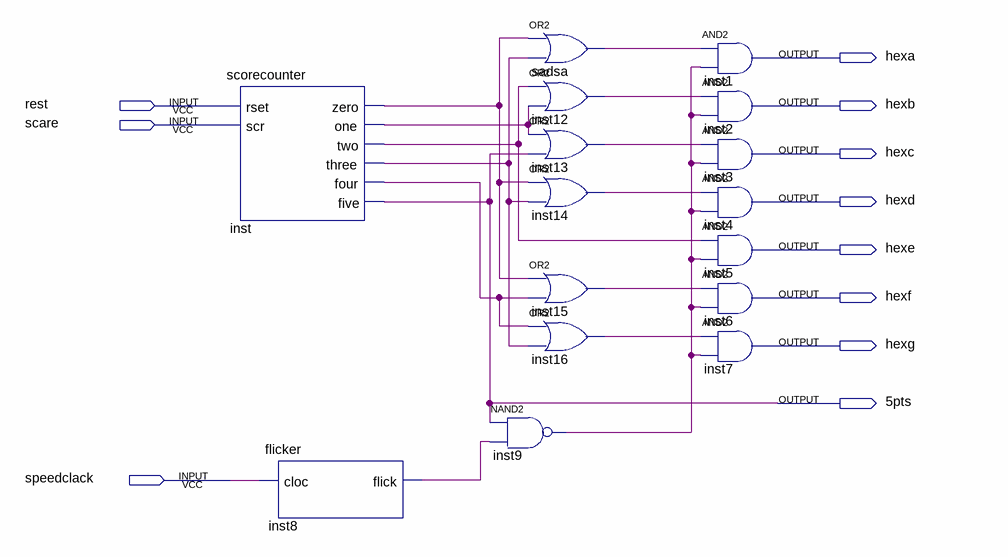
[diagram p0: schematic sheet]
// Quartus schematic scoretracker.bdf as structural Verilog: 16 symbols, 11 pins
module scoretracker (
  input  rest,
  input  scare,
  input  speedclack,
  output hexa,
  output hexb,
  output hexc,
  output hexd,
  output hexe,
  output hexf,
  output hexg,
  output \5pts 
);

  wire inst8_flick, inst9_out, inst12_out, inst13_out, inst14_out, inst15_out, inst16_out, inst_four,
       inst_one, inst_three, inst_two, inst_zero, sadsa_out;

  scorecounter inst (
    .rset(rest), .scr(scare), .zero(inst_zero), .one(inst_one), .two(inst_two), .three(inst_three),
    .four(inst_four), .five(\5pts ));
  flicker inst8 (.cloc(speedclack), .flick(inst8_flick));
  nand inst9 (inst9_out, \5pts , inst8_flick);
  or sadsa (sadsa_out, inst_zero, inst_three);
  or inst12 (inst12_out, inst_two, inst_one);
  or inst13 (inst13_out, inst_one, \5pts );
  or inst14 (inst14_out, inst_zero, inst_three);
  or inst15 (inst15_out, inst_zero, inst_four);
  or inst16 (inst16_out, inst_four, inst_three);
  and inst1 (hexa, sadsa_out, inst9_out);
  and inst2 (hexb, inst12_out, inst9_out);
  and inst3 (hexc, inst13_out, inst9_out);
  and inst4 (hexd, inst14_out, inst9_out);
  and inst5 (hexe, inst_two, inst9_out);
  and inst6 (hexf, inst15_out, inst9_out);
  and inst7 (hexg, inst16_out, inst9_out);
endmodule
